# Altium schematic sheet Sheet1.SchDoc
size A4
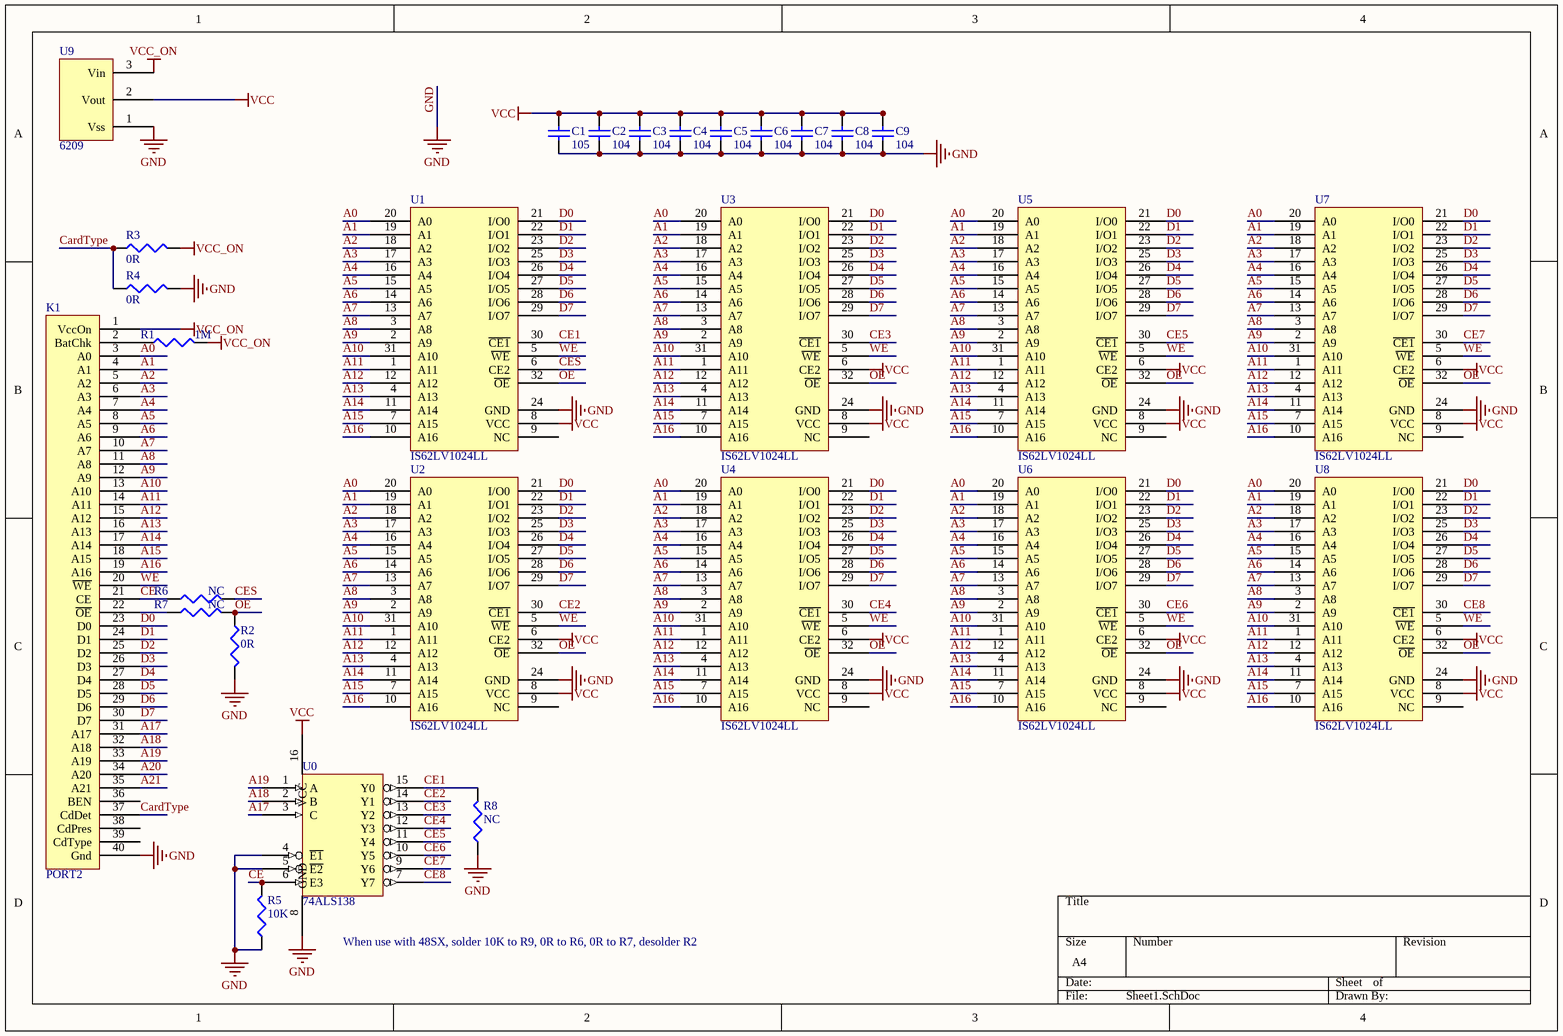
[diagram p0: Sheet1.SchDoc]

## Parts
C1  105  [1608[0603]]
C2  104  [1608[0603]]
C3  104  [1608[0603]]
C4  104  [1608[0603]]
C5  104  [1608[0603]]
C6  104  [1608[0603]]
C7  104  [1608[0603]]
C8  104  [1608[0603]]
C9  104  [1608[0603]]
K1  PORT2  [SOP80]
R1  1M  [J1-0603]
R2  0R  [J1-0603]
R3  0R  [J1-0603]
R4  0R  [J1-0603]
R5  10K  [J1-0603]
R6  NC  [J1-0603]
R7  NC  [J1-0603]
R8  NC  [J1-0603]
U0  74ALS138  [SO-16]
U1  IS62LV1024LL  [TSOP32]
U2  IS62LV1024LL  [TSOP32]
U3  IS62LV1024LL  [TSOP32]
U4  IS62LV1024LL  [TSOP32]
U5  IS62LV1024LL  [TSOP32]
U6  IS62LV1024LL  [TSOP32]
U7  IS62LV1024LL  [TSOP32]
U8  IS62LV1024LL  [TSOP32]
U9  6209  [SOT-23]

## Nets
GND: C1.1 C2.1 C3.1 C4.1 C5.1 C6.1 C7.1 C8.1 C9.1 K1.40(Gnd) R2.2 R4.2 R5.1 R8.1 U0.4(~{E1}) U0.5(~{E2}) U0.8(GND) U1.24(GND) U2.24(GND) U3.24(GND) U4.24(GND) U5.24(GND) U6.24(GND) U7.24(GND) U8.24(GND) U9.1(Vss)
VCC: C1.2 C2.2 C3.2 C4.2 C5.2 C6.2 C7.2 C8.2 C9.2 U0.16(VCC) U1.8(VCC) U2.6(CE2) U2.8(VCC) U3.6(CE2) U3.8(VCC) U4.6(CE2) U4.8(VCC) U5.6(CE2) U5.8(VCC) U6.6(CE2) U6.8(VCC) U7.6(CE2) U7.8(VCC) U8.6(CE2) U8.8(VCC) U9.2(Vout)
VCC_ON: K1.1(VccOn) R1.2 R3.2 U9.3(Vin)
A0: K1.3(A0) U1.20(A0) U2.20(A0) U3.20(A0) U4.20(A0) U5.20(A0) U6.20(A0) U7.20(A0) U8.20(A0)
A1: K1.4(A1) U1.19(A1) U2.19(A1) U3.19(A1) U4.19(A1) U5.19(A1) U6.19(A1) U7.19(A1) U8.19(A1)
A2: K1.5(A2) U1.18(A2) U2.18(A2) U3.18(A2) U4.18(A2) U5.18(A2) U6.18(A2) U7.18(A2) U8.18(A2)
A3: K1.6(A3) U1.17(A3) U2.17(A3) U3.17(A3) U4.17(A3) U5.17(A3) U6.17(A3) U7.17(A3) U8.17(A3)
A4: K1.7(A4) U1.16(A4) U2.16(A4) U3.16(A4) U4.16(A4) U5.16(A4) U6.16(A4) U7.16(A4) U8.16(A4)
A5: K1.8(A5) U1.15(A5) U2.15(A5) U3.15(A5) U4.15(A5) U5.15(A5) U6.15(A5) U7.15(A5) U8.15(A5)
A6: K1.9(A6) U1.14(A6) U2.14(A6) U3.14(A6) U4.14(A6) U5.14(A6) U6.14(A6) U7.14(A6) U8.14(A6)
A7: K1.10(A7) U1.13(A7) U2.13(A7) U3.13(A7) U4.13(A7) U5.13(A7) U6.13(A7) U7.13(A7) U8.13(A7)
A8: K1.11(A8) U1.3(A8) U2.3(A8) U3.3(A8) U4.3(A8) U5.3(A8) U6.3(A8) U7.3(A8) U8.3(A8)
A9: K1.12(A9) U1.2(A9) U2.2(A9) U3.2(A9) U4.2(A9) U5.2(A9) U6.2(A9) U7.2(A9) U8.2(A9)
A10: K1.13(A10) U1.31(A10) U2.31(A10) U3.31(A10) U4.31(A10) U5.31(A10) U6.31(A10) U7.31(A10) U8.31(A10)
A11: K1.14(A11) U1.1(A11) U2.1(A11) U3.1(A11) U4.1(A11) U5.1(A11) U6.1(A11) U7.1(A11) U8.1(A11)
A12: K1.15(A12) U1.12(A12) U2.12(A12) U3.12(A12) U4.12(A12) U5.12(A12) U6.12(A12) U7.12(A12) U8.12(A12)
A13: K1.16(A13) U1.4(A13) U2.4(A13) U3.4(A13) U4.4(A13) U5.4(A13) U6.4(A13) U7.4(A13) U8.4(A13)
A14: K1.17(A14) U1.11(A14) U2.11(A14) U3.11(A14) U4.11(A14) U5.11(A14) U6.11(A14) U7.11(A14) U8.11(A14)
A15: K1.18(A15) U1.7(A15) U2.7(A15) U3.7(A15) U4.7(A15) U5.7(A15) U6.7(A15) U7.7(A15) U8.7(A15)
A16: K1.19(A16) U1.10(A16) U2.10(A16) U3.10(A16) U4.10(A16) U5.10(A16) U6.10(A16) U7.10(A16) U8.10(A16)
A17: K1.31(A17) U0.3(C)
A18: K1.32(A18) U0.2(B)
A19: K1.33(A19) U0.1(A)
A20: K1.34(A20)
A21: K1.35(A21)
CardType: K1.37(CdDet) R3.1 R4.1
CE: K1.21(CE) R5.2 R6.1 U0.6(E3)
CE1: R8.2 U0.15(Y0) U1.30(~{CE1})
CE2: U0.14(Y1) U2.30(~{CE1})
CE3: U0.13(Y2) U3.30(~{CE1})
CE4: U0.12(Y3) U4.30(~{CE1})
CE5: U0.11(Y4) U5.30(~{CE1})
CE6: U0.10(Y5) U6.30(~{CE1})
CE7: U0.9(Y6) U7.30(~{CE1})
CE8: U0.7(Y7) U8.30(~{CE1})
CES: R6.2 U1.6(CE2)
D0: K1.23(D0) U1.21(I/O0) U2.21(I/O0) U3.21(I/O0) U4.21(I/O0) U5.21(I/O0) U6.21(I/O0) U7.21(I/O0) U8.21(I/O0)
D1: K1.24(D1) U1.22(I/O1) U2.22(I/O1) U3.22(I/O1) U4.22(I/O1) U5.22(I/O1) U6.22(I/O1) U7.22(I/O1) U8.22(I/O1)
D2: K1.25(D2) U1.23(I/O2) U2.23(I/O2) U3.23(I/O2) U4.23(I/O2) U5.23(I/O2) U6.23(I/O2) U7.23(I/O2) U8.23(I/O2)
D3: K1.26(D3) U1.25(I/O3) U2.25(I/O3) U3.25(I/O3) U4.25(I/O3) U5.25(I/O3) U6.25(I/O3) U7.25(I/O3) U8.25(I/O3)
D4: K1.27(D4) U1.26(I/O4) U2.26(I/O4) U3.26(I/O4) U4.26(I/O4) U5.26(I/O4) U6.26(I/O4) U7.26(I/O4) U8.26(I/O4)
D5: K1.28(D5) U1.27(I/O5) U2.27(I/O5) U3.27(I/O5) U4.27(I/O5) U5.27(I/O5) U6.27(I/O5) U7.27(I/O5) U8.27(I/O5)
D6: K1.29(D6) U1.28(I/O6) U2.28(I/O6) U3.28(I/O6) U4.28(I/O6) U5.28(I/O6) U6.28(I/O6) U7.28(I/O6) U8.28(I/O6)
D7: K1.30(D7) U1.29(I/O7) U2.29(I/O7) U3.29(I/O7) U4.29(I/O7) U5.29(I/O7) U6.29(I/O7) U7.29(I/O7) U8.29(I/O7)
OE: R2.1 R7.2 U1.32(~{OE}) U2.32(~{OE}) U3.32(~{OE}) U4.32(~{OE}) U5.32(~{OE}) U6.32(~{OE}) U7.32(~{OE}) U8.32(~{OE})
WE: K1.20(~{WE}) U1.5(~{WE}) U2.5(~{WE}) U3.5(~{WE}) U4.5(~{WE}) U5.5(~{WE}) U6.5(~{WE}) U7.5(~{WE}) U8.5(~{WE})
NetK1_2: K1.2(BatChk) R1.1
NetK1_22: K1.22(~{OE}) R7.1

Not connected (* = marked no-connect by the designer): K1 36(BEN) 38(CdPres) 39(CdType); U1 9(NC); U2 9(NC); U3 9(NC); U4 9(NC); U5 9(NC); U6 9(NC); U7 9(NC); U8 9(NC)

## Notes on the sheet
- When use with 48SX, solder 10K to R9, 0R to R6, 0R to R7, desolder R2

## Library data of the parts
C1-C9 = Cap Semi: Capacitor (Semiconductor SIM Model); Value: 100pF; Published: 8-Jun-2000; LatestRevisionDate: 29-May-2009; LatestRevisionNote: IPC-7351 Footprint Added.; PackageReference: C1206; Publisher: Altium Limited; PackageDescription: Chip Capacitor
R1-R8 = Res3: Resistor; Value: 1K; Published: 8-Jun-2000; LatestRevisionDate: 29-May-2009; LatestRevisionNote: IPC-7351 Footprint Added.; PackageReference: J1-0603; Publisher: Altium Limited; PackageDescription: Chip Resistor